# Altium schematic sheet Testing List.SchDoc
size A; SheetNumber: 3; SheetTotal: 3
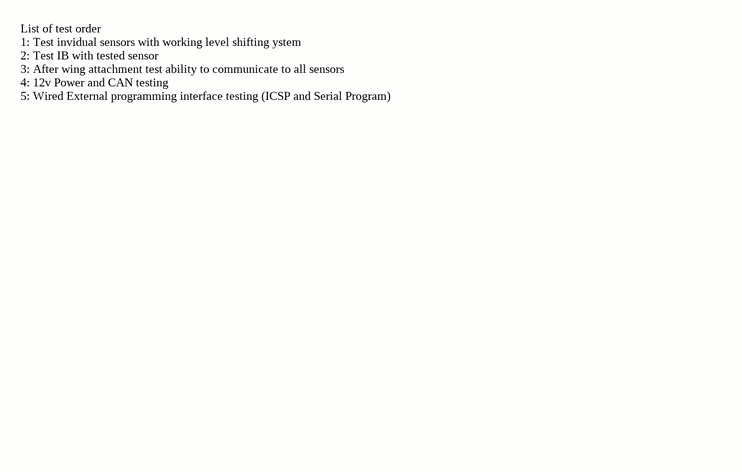
[diagram p0: Testing List.SchDoc]

## Notes on the sheet
- List of test order
  1: Test invidual sensors with working level shifting ystem
  2: Test IB with tested sensor
  3: After wing attachment test ability to communicate to all sensors
  4: 12v Power and CAN testing
  5: Wired External programming interface testing (ICSP and Serial Program)